# EAGLE schematic prominifinal (EAGLE 9.6.2)
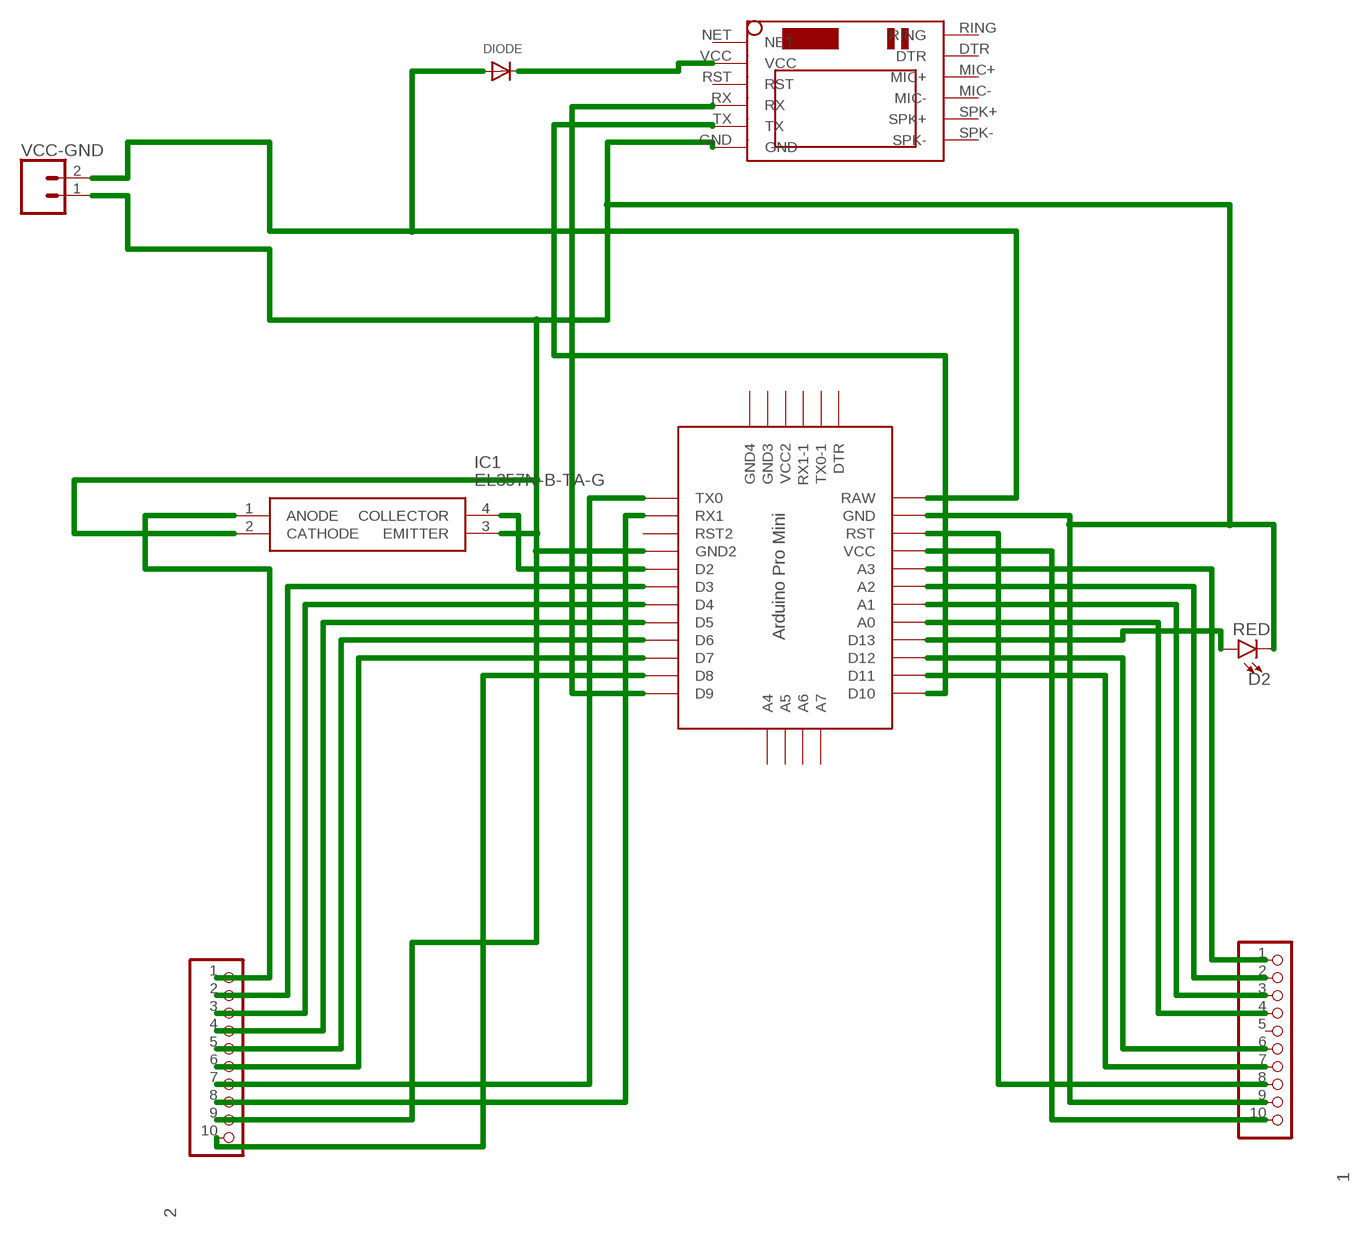
[diagram p0: schematic, sheet 1]

## Parts
1  PINHD-1X10  [1X10]
2  PINHD-1X10  [1X10]
D2  RED  LED-RED1206  [LED-1206]
DIODE  DIODESOD-323F  [SOD-323F]
IC1  EL357N-B-TA-G  [SOP254P700X200-4N]
PROMINI  PRO-MINI  [PRO-MINI]
U$1  SIM800LMODULE  [SIM800LMODULE]
VCC-GND  CONN_025MM  [SCREWTERMINAL-5MM-2]

## Nets
D2,D3,D4,D5-IO0,D6-IO2,D7-IO4,D8-IO5,D9-IO9,GND,VIN: 2.6 PROMINI.D7
N$1: DIODE.A PROMINI.RAW VCC-GND.2
N$2: 2.8 PROMINI.RX1
N$3: DIODE.C U$1.VCC
N$4: 1.10 PROMINI.VCC
N$5: IC1.4(COLLECTOR) PROMINI.D2
N$6: PROMINI.D9 U$1.RX
N$7: D2.A PROMINI.D13
N$8: 2.1 IC1.1(ANODE)
N$9: 2.2 PROMINI.D3
N$10: 2.3 PROMINI.D4
N$11: 2.4 PROMINI.D5
N$12: 2.5 PROMINI.D6
N$13: 1.8 PROMINI.RST
N$14: 2.7 PROMINI.TX0
N$15: 2.10 PROMINI.D8
N$16: 1.1 PROMINI.A3
N$17: 1.2 PROMINI.A2
N$18: 1.3 PROMINI.A1
N$19: 1.4 PROMINI.A0
N$21: 1.6 PROMINI.D12
N$22: 1.7 PROMINI.D11
N$23: PROMINI.D10 U$1.TX
N$26: 1.9 2.9 D2.C IC1.2(CATHODE) IC1.3(EMITTER) PROMINI.GND PROMINI.GND1(GND2) U$1.GND VCC-GND.1
Unconnected: 1.5 PROMINI.A4 PROMINI.A5 PROMINI.A6 PROMINI.A7 PROMINI.DTR PROMINI.GND2(GND4) PROMINI.GND3 PROMINI.RST1(RST2) PROMINI.RX1-1 PROMINI.TX0-1 PROMINI.VCC1(VCC2) U$1.DTR U$1.MIC+ U$1.MIC- U$1.NET U$1.RING U$1.RST U$1.SPK+ U$1.SPK-

## Library data of the parts
1 2 = pinhead:PINHD-1X10: PIN HEADER
D2 = SparkFun-LED:LED-RED: Red SMD LED Used in manufacturing of most products at SparkFun Packages: 0603 - SMD 0603 package [Product Link] <http://docs.avagotech.com/docs/AV02-0551EN> 0603 SMART - SMD 0603 SMART package ( more efficient and expensive)[Product Link] <http://www.osram-os.com/Graphics/XPic2/00077099_0.pdf> 1206 - SMD1206 package [Product Link] <https://www.sparkfun.com/datasheets/DevTools/LilyPad/Q150OVS4.pdff> SparkFun Products: Pro Mini 328 -5V <https://www.sparkfun.com/products/821> RedBoard <https://www.sparkfun.com/products/12757> IOIO-OTG <https://www.sparkfun.com/products/13613>; PROD_ID: DIO-09912
DIODE = adafruit:DIODE: Diode SMADIODE - SMA Surface Mount Package 20V 1A Schottky Diode Digikey: 641-1014-6-ND DO-1N4148 - Through Hole Small Current Diode SOD-123 20V 1 A (.5mV Vf) Schottky Diode - Digikey: MBRX120TPMSCT-ND SOD-323 10V 570mA (.38mV Vf, 3ns) Schottky Diode - Digikey: ZLLS410CT-ND SOD-523 30V 30mA Schottky Diode (RB751S-40TE61) - Digikey: RB751S-40TE61CT-ND SOT23-R/W - SOT23 Package (R = Solder Paste/Reflow Ovens, W = Hand-Soldering) BAT54Film 40V 300mA - Digikey: 497-7162-1-ND
IC1 = EL357N-B-TA-G:EL357N-B-TA-G: Optoisolator Transistor Output 3750Vrms 1 Channel 4-SOP (2.54mm) Source: Datasheet <https://datasheet.lcsc.com/szlcsc/1809192312_Everlight-Elec-EL357N-B-TA-G_C6649.pdf>; DESCRIPTION: Optoisolator Transistor Output 3750Vrms 1 Channel 4-SOP (2.54mm); HEIGHT: 2mm; MANUFACTURER_NAME: Everlight Elec; MANUFACTURER_PART_NUMBER: EL357N-B-TA-G
PROMINI = Arduino-clone:PRO-MINI: Arduion Pro Mini Clone V1.0 www.betemcu.cu
U$1 = SIM800LMODULE:SIM800LMODULE: SIM800L Module
VCC-GND = SparkFun-Retired:CONN_02: Multi connection point. Often used as Generic Header-pin footprint for 0.1 inch spaced/style header connections On any of the 0.1 inch spaced packages, you can populate with these: Break Away Headers - Straight <https://www.sparkfun.com/products/116> (PRT-00116) Break Away Male Headers - Right Angle <https://www.sparkfun.com/products/553> (PRT-00553) Female Headers <https://www.sparkfun.com/products/115> (PRT-00115) Break Away Headers - Machine Pin <https://www.sparkfun.com/products/117> (PRT-00117) Break Away Female Headers - Swiss Machine Pin <https://www.sparkfun.com/products/743> (PRT-00743) For SCREWTERMINALS and SPRING TERMINALS visit here: Screw Terimnals on SparkFun.com <https://www.sparkfun.com/search/results?term=Screw+Terminals> (5mm/3.5mm/2.54mm spacing) This device is also useful as a general connection point to wire up your design to another part of your project. Our various solder wires solder well into these plated through hole pads. Hook-Up Wire - Assortment (Stranded, 22 AWG) <https://www.sparkfun.com/products/11375> (PRT-11375) Hook-Up Wire - Assortment (Solid Core, 22 AWG) <https://www.sparkfun.com/products/11367> (PRT-11367) View the entire wire category on our website here <https://www.sparkfun.com/categories/141> Special notes: Molex polarized connector foot print use with: PRT-08233 with associated crimp pins and housings. 2.54_SCREWTERM for use with PRT-10571. 3.5mm Screw Terminal footprints for PRT-08084 5mm Screw Terminal footprints for use with PRT-08432; SF_SKU: PRT-08432